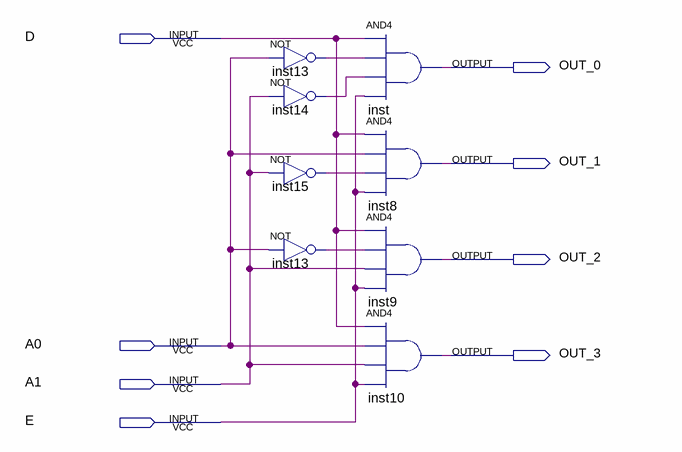
[diagram p0: schematic sheet]
// Quartus schematic DMUX2-1.bdf as structural Verilog: 8 symbols, 8 pins
module \DMUX2-1  (
  input  D,
  input  A0,
  input  A1,
  input  E,
  output OUT_0,
  output OUT_1,
  output OUT_2,
  output OUT_3
);

  wire inst13_out, inst13_out_2, inst14_out, inst15_out;

  not inst13 (inst13_out, A0);
  not inst14 (inst14_out, A1);
  not inst15 (inst15_out, A1);
  not inst13_dup2 (inst13_out_2, A0);
  and inst (OUT_0, D, inst13_out, inst14_out, E);
  and inst8 (OUT_1, D, A0, inst15_out, E);
  and inst9 (OUT_2, D, inst13_out_2, A1, E);
  and inst10 (OUT_3, D, A0, A1, E);
endmodule
